# EAGLE schematic schemat (EAGLE 9.6.2)
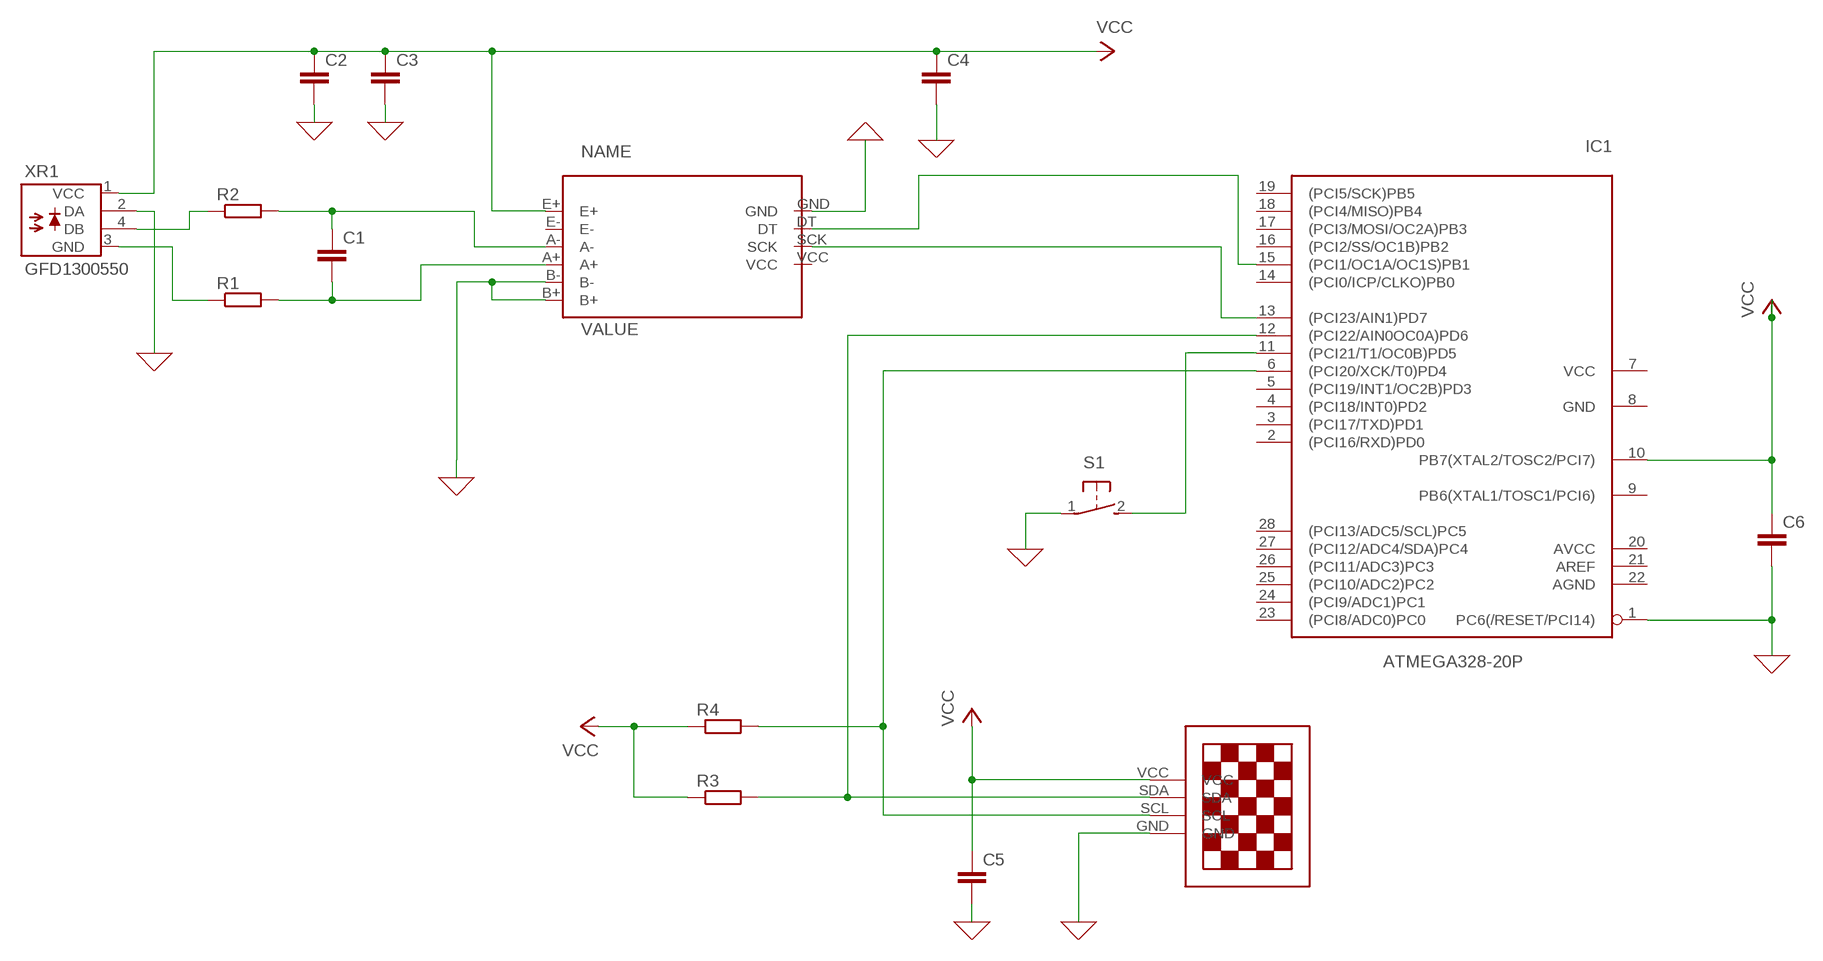
[diagram p0: schematic, sheet 1]

## Parts
C1  C2,5-3  [C2.5-3]
C2  C2,5-3  [C2.5-3]
C3  C2,5-3  [C2.5-3]
C4  C2,5-3  [C2.5-3]
C5  C2,5-3  [C2.5-3]
C6  C2,5-3  [C2.5-3]
IC1  ATMEGA328-20P  [DIL28-3]
R1  R-EU_0204/2V  [0204V]
R2  R-EU_0204/2V  [0204V]
R3  R-EU_0204/2V  [0204V]
R4  R-EU_0204/2V  [0204V]
S1  31-XX  [B3F-31XX]
U$1  HX711A  [HX711]
U$2  13"OLED13"OLED  [1.3"OLED]
XR1  GFD1300550  [GFD1300]

## Nets
0: C2.2 C3.2 C4.2 C5.2 C6.2 IC1.1(PC6(/RESET/PCI14)) S1.1(P) U$1.B+ U$1.B- U$1.GND U$2.GND XR1.2(DA) ; supply symbol labelled GND
N$1: R1.1 XR1.3(GND)
N$2: C1.2 R1.2 U$1.A+
N$3: R2.1 XR1.4(DB)
N$4: C1.1 R2.2 U$1.A-
N$6: IC1.15((PCI1/OC1A/OC1S)PB1) U$1.DT
N$7: IC1.13((PCI23/AIN1)PD7) U$1.SCK
N$8: IC1.6((PCI20/XCK/T0)PD4) R4.2 U$2.SCL
N$9: IC1.11((PCI21/T1/OC0B)PD5) S1.2(S)
N$10: IC1.12((PCI22/AIN0OC0A)PD6) R3.2 U$2.SDA
VCC: C2.1 C3.1 C4.1 C5.1 C6.1 IC1.10(PB7(XTAL2/TOSC2/PCI7)) R3.1 R4.1 U$1.E+ U$2.VCC XR1.1(VCC)
Unconnected: IC1.2((PCI16/RXD)PD0) IC1.3((PCI17/TXD)PD1) IC1.4((PCI18/INT0)PD2) IC1.5((PCI19/INT1/OC2B)PD3) IC1.7(VCC) IC1.8(GND) IC1.9(PB6(XTAL1/TOSC1/PCI6)) IC1.14((PCI0/ICP/CLKO)PB0) IC1.16((PCI2/SS/OC1B)PB2) IC1.17((PCI3/MOSI/OC2A)PB3) IC1.18((PCI4/MISO)PB4) IC1.19((PCI5/SCK)PB5) IC1.20(AVCC) IC1.21(AREF) IC1.22(AGND) IC1.23((PCI8/ADC0)PC0) IC1.24((PCI9/ADC1)PC1) IC1.25((PCI10/ADC2)PC2) IC1.26((PCI11/ADC3)PC3) IC1.27((PCI12/ADC4/SDA)PC4) IC1.28((PCI13/ADC5/SCL)PC5) U$1.E- U$1.VCC

## Library data of the parts
C1-C6 = capacitor-wima:C: CAPACITOR naming: grid - package width
IC1 = atmega328:ATMEGA328*P: MICROCONTROLLER 32 kBytes FLASH 2 kBytes SRAM 1 kBytes EEPROM USART 8-channel 10 bit ADC
R1-R4 = rcl:R-EU_: RESISTOR, European symbol; SPICEPREFIX: R
S1 = switch-omron:31-XX: OMRON SWITCH; MPN: B3F-3100; OC_FARNELL: 959704; OC_NEWARK: 36M3582
U$1 = HX711:HX711
U$2 = 13oled:13"OLED
XR1 = opto-honeywell:GFD1300550: OPTO SENSOR DEVICE; OC_FARNELL: unknown; OC_NEWARK: unknown